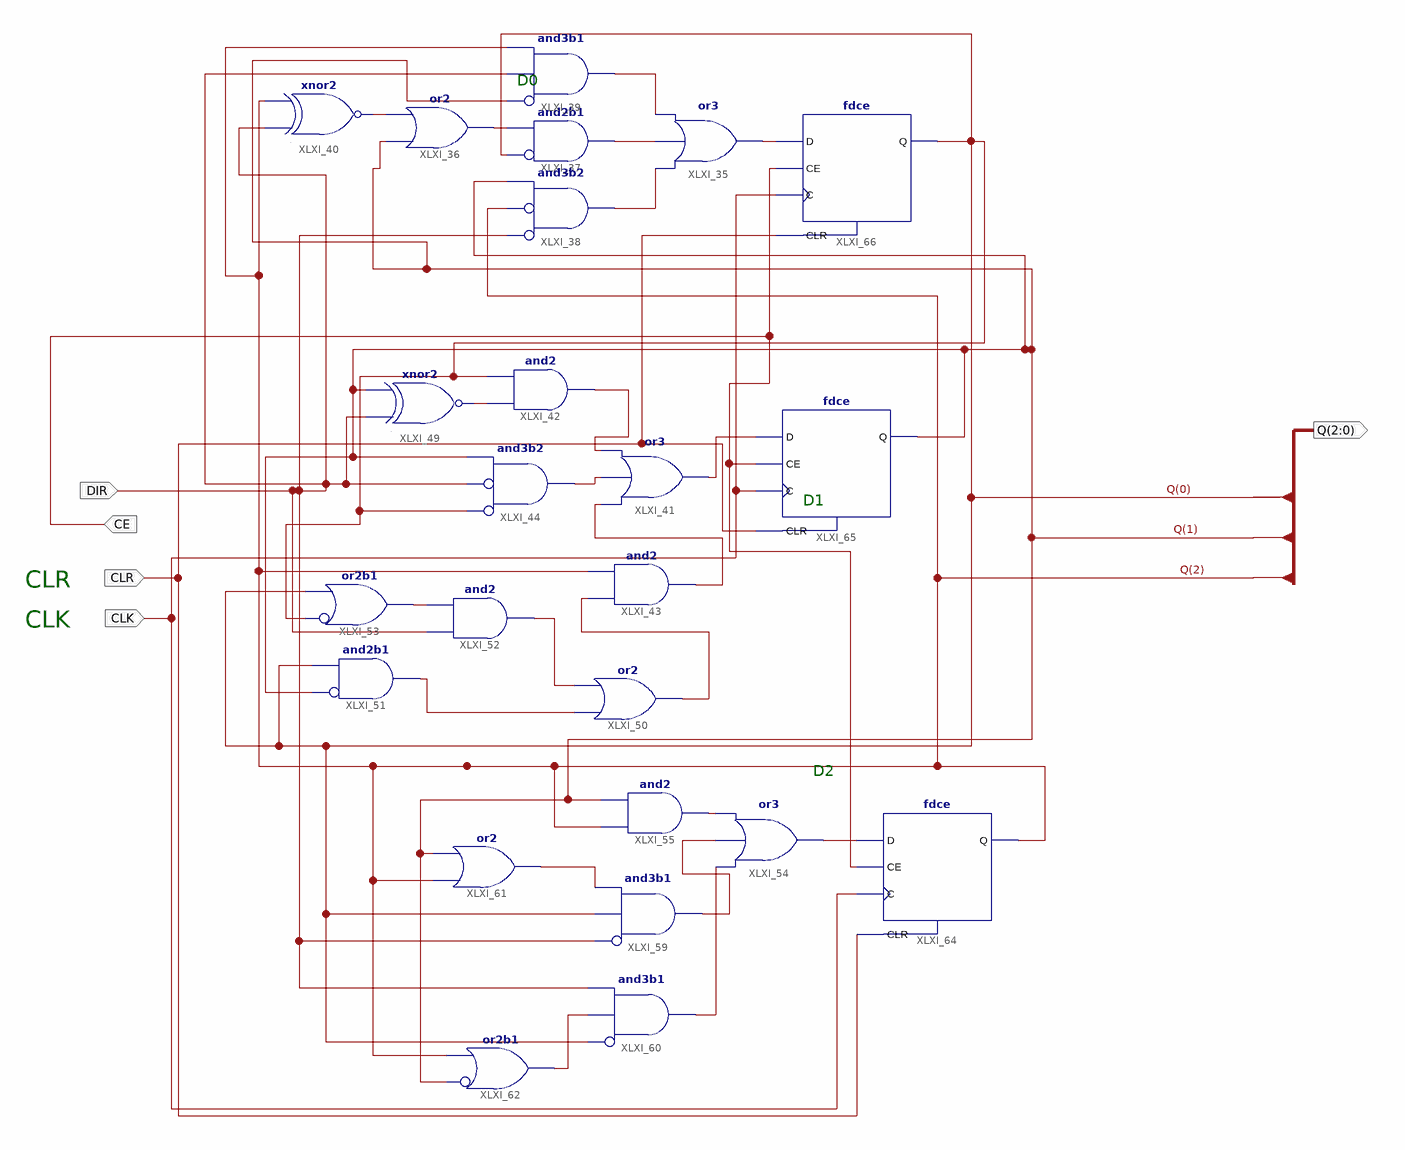
[diagram p0: schematic sheet 1]
// Xilinx ISE schematic Schemat.sch (xc9500xl) as structural Verilog: 24 symbols, 5 ports
module Schemat (
  input  DIR,
  input  CLR,
  input  CLK,
  input  CE,
  output [2:0] Q
);

  wire XLXN_69, XLXN_70, XLXN_71, XLXN_72, XLXN_73, XLXN_74, XLXN_83, XLXN_84, XLXN_86, XLXN_87, XLXN_94,
       XLXN_95, XLXN_97, XLXN_100, XLXN_109, XLXN_116, XLXN_117, XLXN_129, XLXN_130, XLXN_137, XLXN_138;

  or XLXI_35 (XLXN_69, XLXN_73, XLXN_72, XLXN_74);
  or XLXI_36 (XLXN_70, Q[1], XLXN_71);
  and XLXI_37 (XLXN_72, ~Q[0], XLXN_70);  // and2b1
  and XLXI_38 (XLXN_73, ~DIR, ~Q[2], Q[1]);  // and3b2
  and XLXI_39 (XLXN_74, ~Q[1], DIR, Q[2]);  // and3b1
  xnor XLXI_40 (XLXN_71, DIR, Q[2]);
  or XLXI_41 (XLXN_83, XLXN_86, XLXN_87, XLXN_84);
  and XLXI_42 (XLXN_84, XLXN_94, Q[0]);
  and XLXI_43 (XLXN_86, XLXN_95, Q[2]);
  and XLXI_44 (XLXN_87, ~Q[0], ~DIR, Q[1]);  // and3b2
  xnor XLXI_49 (XLXN_94, DIR, Q[1]);
  or XLXI_50 (XLXN_95, XLXN_97, XLXN_109);
  and XLXI_51 (XLXN_97, ~Q[1], Q[0]);  // and2b1
  and XLXI_52 (XLXN_109, DIR, XLXN_100);
  or XLXI_53 (XLXN_100, ~Q[0], Q[0]);  // or2b1
  or XLXI_54 (XLXN_116, XLXN_130, XLXN_129, XLXN_117);
  and XLXI_55 (XLXN_117, Q[2], Q[1]);
  and XLXI_59 (XLXN_129, ~DIR, Q[0], XLXN_138);  // and3b1
  and XLXI_60 (XLXN_130, ~Q[0], XLXN_137, DIR);  // and3b1
  or XLXI_61 (XLXN_138, Q[2], Q[1]);
  or XLXI_62 (XLXN_137, ~Q[1], Q[2]);  // or2b1
  fdce XLXI_64 (.C(CLK), .CE(CE), .CLR(CLR), .D(XLXN_116), .Q(Q[2]));
  fdce XLXI_65 (.C(CLK), .CE(CE), .CLR(CLR), .D(XLXN_83), .Q(Q[1]));
  fdce XLXI_66 (.C(CLK), .CE(CE), .CLR(CLR), .D(XLXN_69), .Q(Q[0]));

  // Notes on the sheet:
  //   D0
  //   D1
  //   CLR
  //   CLK
  //   D2
endmodule
